# EAGLE design Pneumatic Controller Schematic (EAGLE 7.6.0)
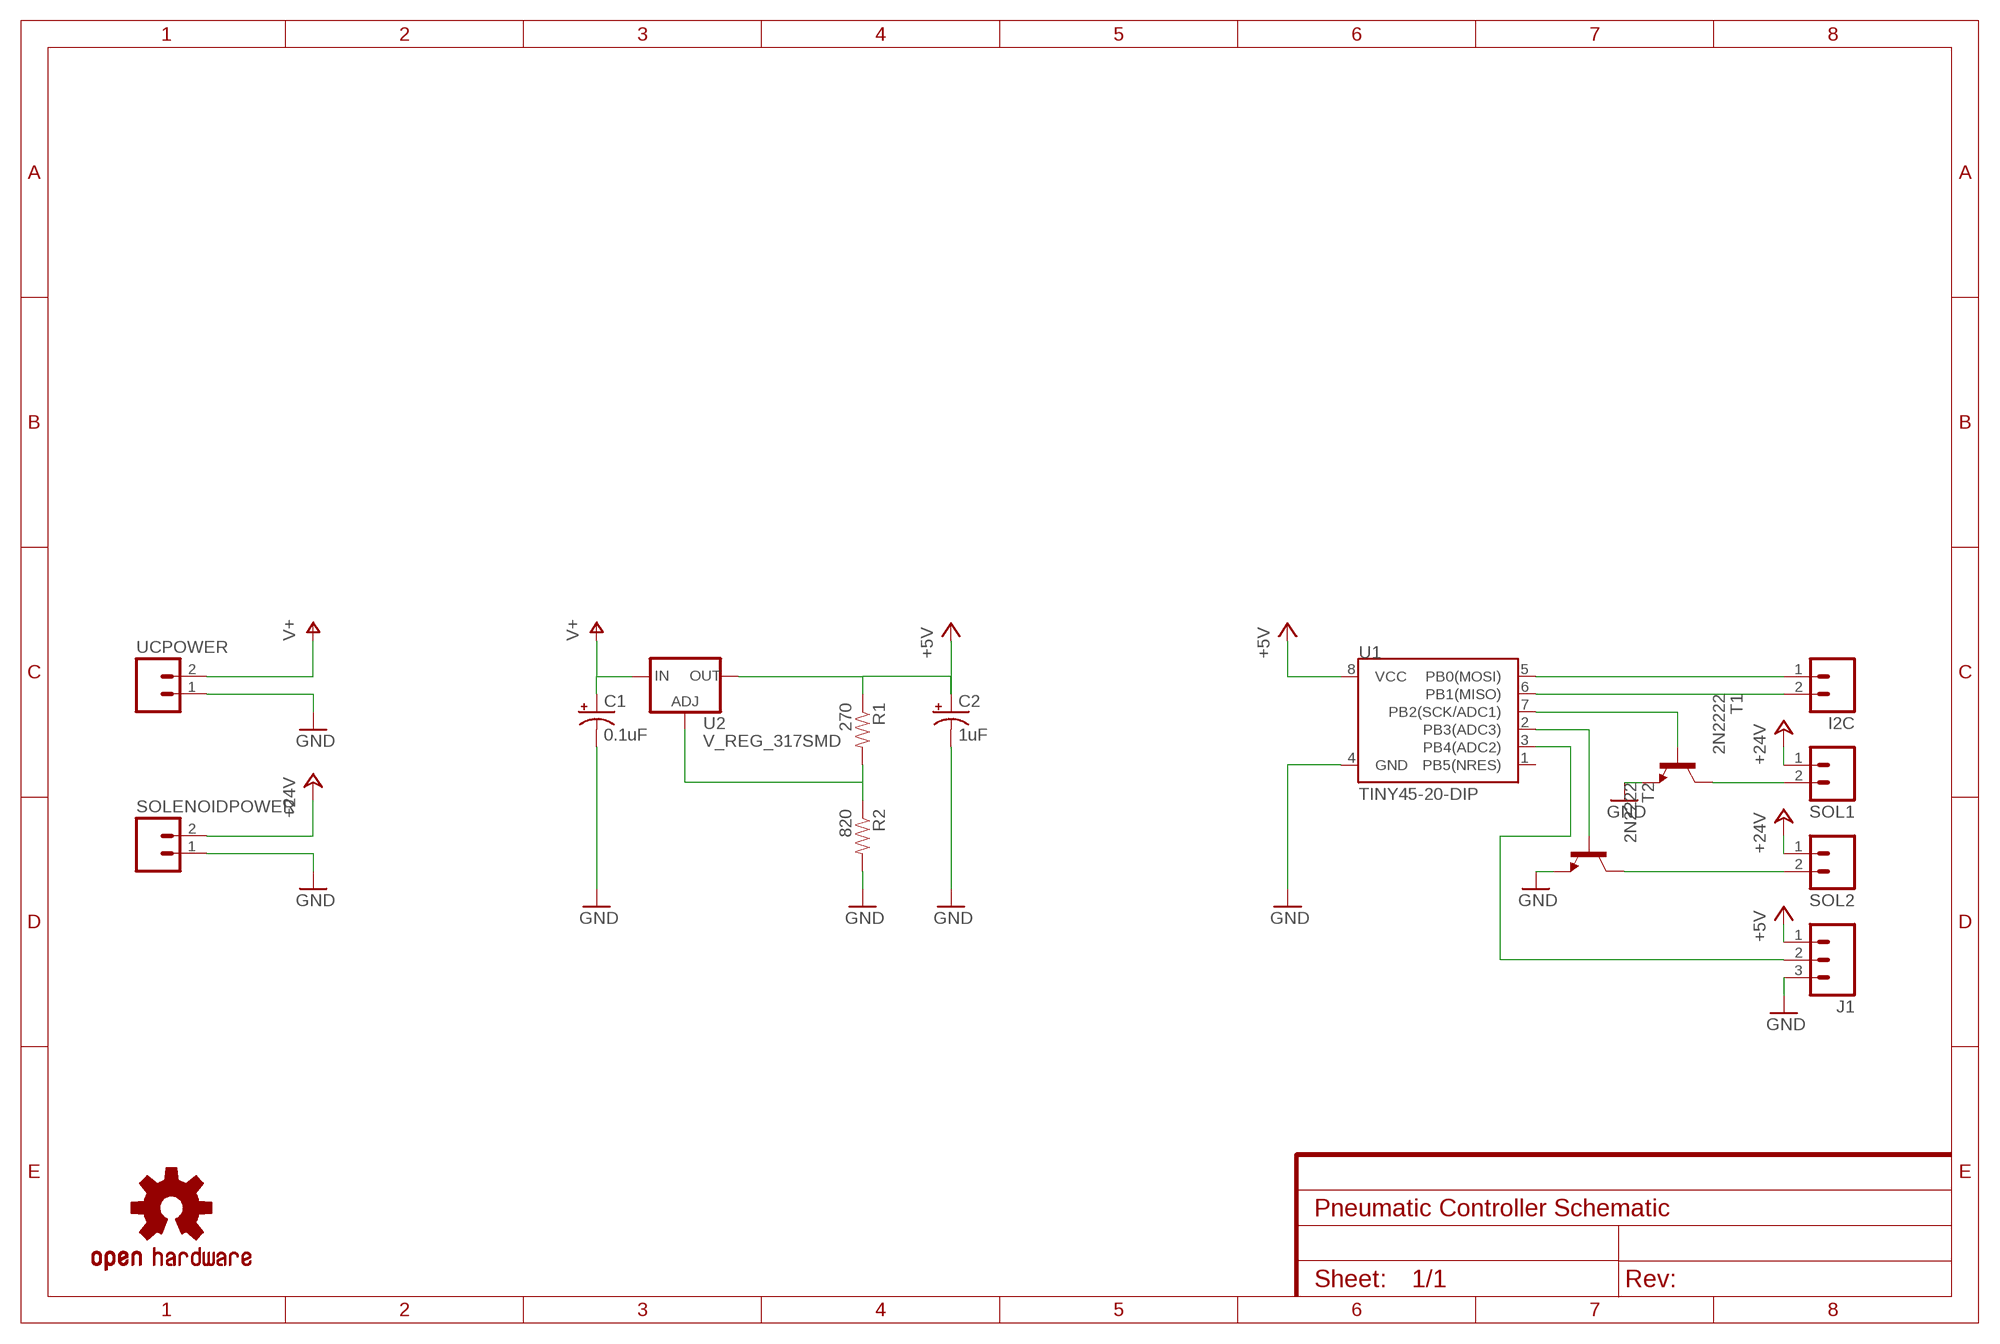
[diagram p0: schematic, sheet 1]

## Parts
C1  0.1uF  CAP_POLPTH2  [CPOL-RADIAL-10UF-25V]
C2  1uF  CAP_POLPTH2  [CPOL-RADIAL-10UF-25V]
I2C  M02PTH  [1X02]
J1  M03PTH  [1X03]
LOGO1  OSHW-LOGOS-COPPER  [OSHW-LOGO-S_COPPER]
R1  270  RESISTORPTH-1/4W  [AXIAL-0.4]
R2  820  RESISTORPTH-1/4W  [AXIAL-0.4]
SOL1  M02PTH  [1X02]
SOL2  M02PTH  [1X02]
SOLENOIDPOWER  M02PTH  [1X02]
T1  2N2222  [TO92-EBC-OVAL]
T2  2N2222  [TO92-EBC-OVAL]
U1  TINY45-20-DIP  ATTINY45TINY45-20-DIP  [DIP08]
U2  V_REG_317SMD  [SOT223]
UCPOWER  M02PTH  [1X02]

## Nets
+5V: C2.1(+) J1.1 R1.P$1 U1.8(VCC) U2.2(OUT)
+12V: UCPOWER.2 ; supply symbol labelled V+
+24V: SOL1.1 SOL2.1 SOLENOIDPOWER.2
GND: C1.2(-) C2.2(-) J1.3 R2.P$2 SOLENOIDPOWER.1 T1.E T2.E U1.4(GND) UCPOWER.1
N$1: R1.P$2 R2.P$1 U2.1(ADJ)
N$2: I2C.1 U1.5(PB0(MOSI))
N$3: I2C.2 U1.6(PB1(MISO))
N$4: T1.B U1.7(PB2(SCK/ADC1))
N$5: T2.B U1.2(PB3(ADC3))
N$6: SOL1.2 T1.C
N$7: SOL2.2 T2.C
N$8: J1.2 U1.3(PB4(ADC2))
V+: C1.1(+) U2.3(IN)
Unconnected: U1.1(PB5(NRES))

## Library data of the parts
C1 C2 = SparkFun-Capacitors:CAP_POL: Capacitor Polarized These are standard SMD and PTH capacitors. Normally 10uF, 47uF, and 100uF in electrolytic and tantalum varieties. Always verify the external diameter of the through hole cap, it varies with capacity, voltage, and manufacturer. The EIA devices should be standard.
I2C SOL1 SOL2 SOLENOIDPOWER UCPOWER = SparkFun-Connectors:M02: Standard 2-pin 0.1" header. Use with - straight break away headers ( PRT-00116) - right angle break away headers (PRT-00553) - swiss pins (PRT-00743) - machine pins (PRT-00117) - female headers (PRT-00115) Molex polarized connector foot print use with: PRT-08233 with associated crimp pins and housings. 2.54_SCREWTERM for use with PRT-10571. 3.5mm Screw Terminal footprints for PRT-08084 5mm Screw Terminal footprints for use with PRT-08432
J1 = SparkFun-Connectors:M03: Header 3 Standard 3-pin 0.1" header. Use with straight break away headers (SKU : PRT-00116), right angle break away headers (PRT-00553), swiss pins (PRT-00743), machine pins (PRT-00117), and female headers (PRT-00115). Molex polarized connector foot print use with SKU : PRT-08232 with associated crimp pins and housings.
LOGO1 = SparkFun-Aesthetics:OSHW-LOGO: Open Source Hardware Logo This logo indicates the piece of hardware it is found on incorporates a OSHW license and/or adheres to the definition of open source hardware found here: http://freedomdefined.org/OSHW
R1 R2 = SparkFun-Passives:RESISTOR: Resistor Basic schematic elements and footprints for 0603, 1206, and PTH resistors.
T1 T2 = adafruit:2N2222: NPN TRANSISTOR Big oval pads
U1 = SparkFun-DigitalIC:ATTINY45: Atmel 8-pin 2/4/8kB flash uC; PROD_ID: IC-09439
U2 = SparkFun-PowerIC:V_REG_317: Voltage Regulator Standard LM317 adjustable voltage regulator. AOI (Adjust Output Input). Google 'LM317 Calculator' for easy to use app to get the two resistor values needed. 240/720 for 5V output. 240/390 for 3.3V output. Spark Fun Electronics SKU : COM-00527

## Board
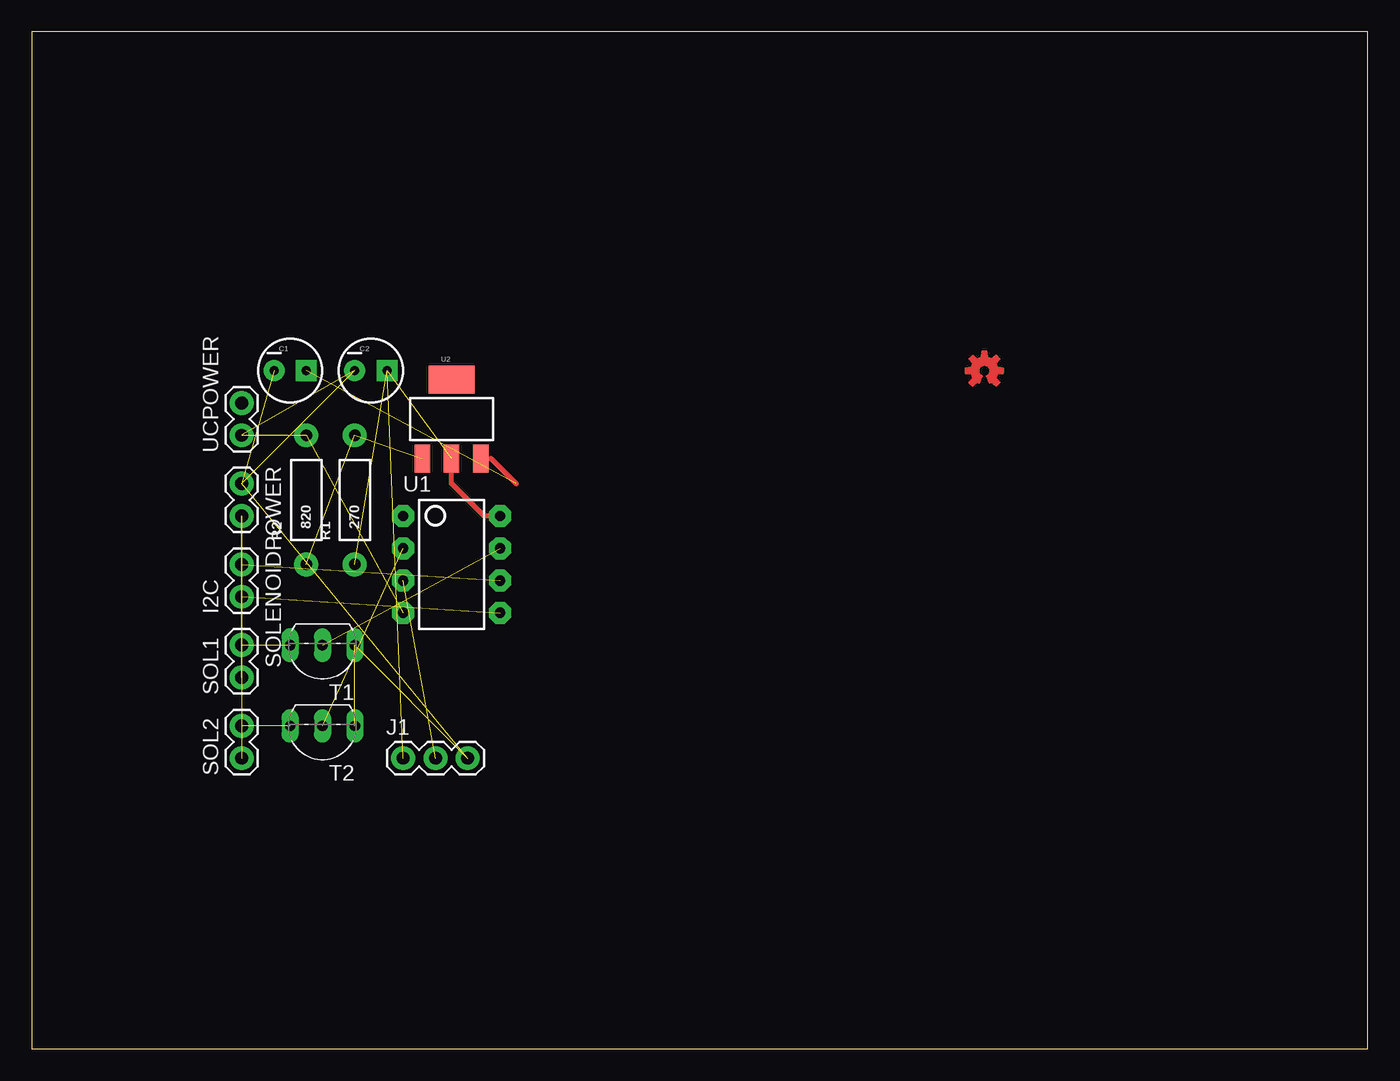
[diagram p1: board, top side]
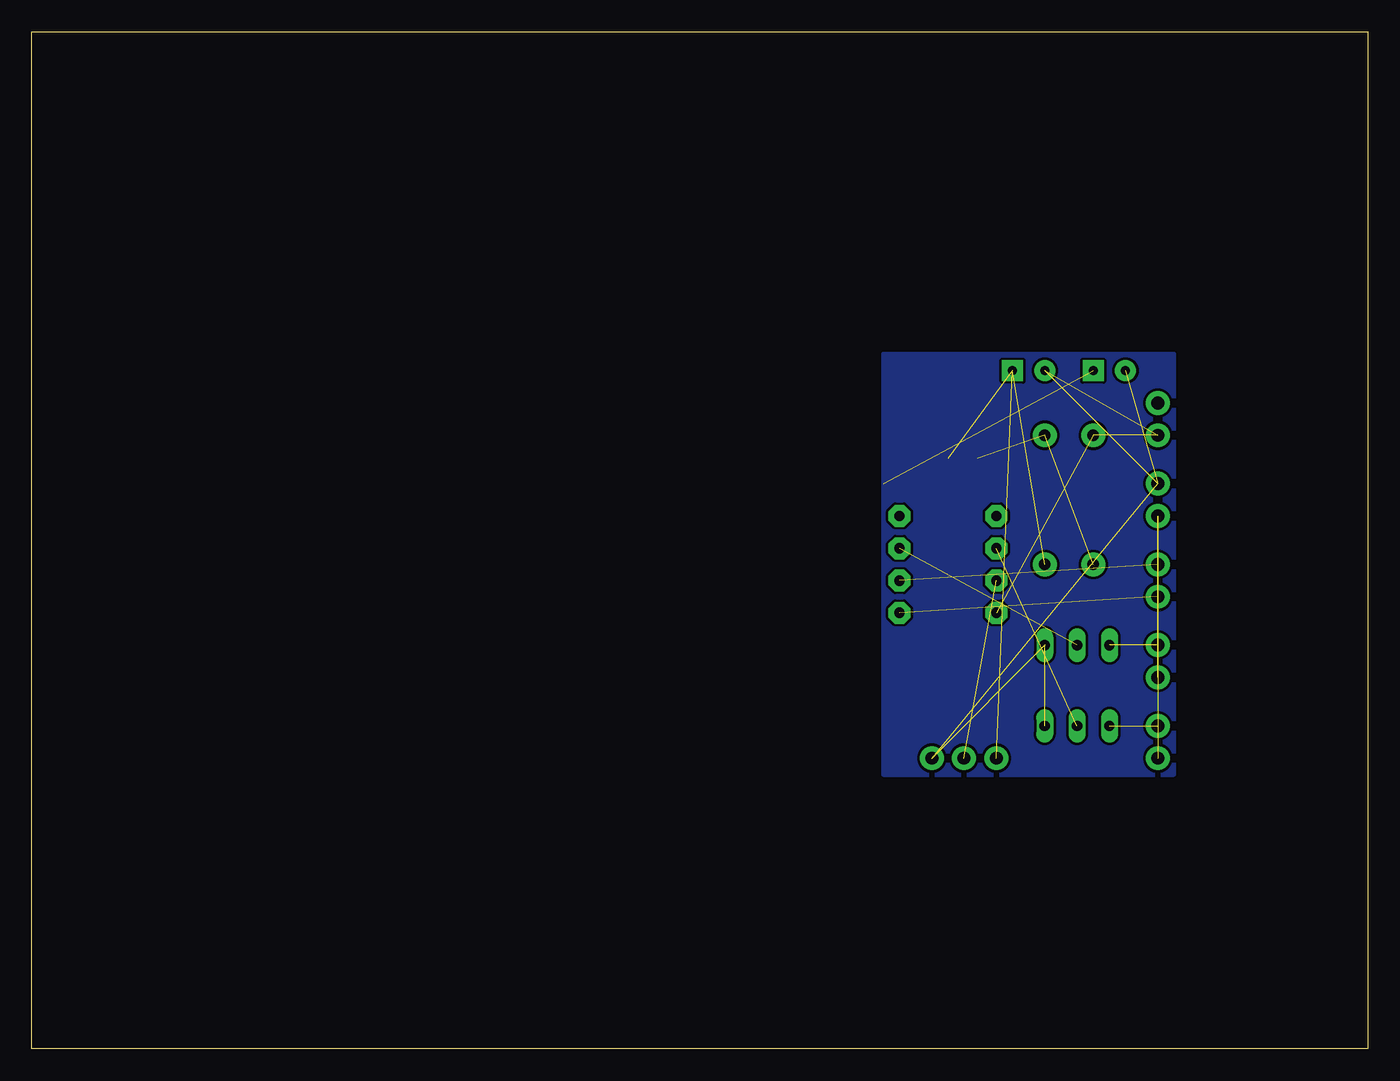
[diagram p2: board, bottom side, seen from below]

Size 105.08 x 80 mm. Coordinates in mm from the lower left corner, seen from the top.
Outline: 0,0 105.08,0 105.08,80 0,80 0,0
Copper layers (1*16): Top 0.035mm / dielectric 1.5mm / Bottom 0.035mm
Design rules "default": minimum track width 10mil, minimum drill 24mil, track to track 8mil, track to pad 8mil, pad to pad 8mil, via to via 8mil, smd to smd 8mil, copper to edge 40mil, drill to drill 8mil, minimum pad ring 10mil, minimum via ring 8mil, stop-mask expansion 4mil, vias tented up to drill 0mil, thermal gap 10mil

### Footprints (pad centres in the part's own frame; a part is rotated, then mirrored left to right if it is on the bottom)
CPOL-RADIAL-10UF-25V = drill 0.7 pad 1.651 square: 1 1.27,0 | drill 0.7 pad 1.651: 2 -1.27,0
1X02 = drill 1.016 pad 1.88: 1 0,0; 2 2.54,0
1X03 = drill 1.016 pad 1.88: 1 0,0; 2 2.54,0; 3 5.08,0
AXIAL-0.4 = drill 0.9 pad 1.88: P$1 -5.08,0; P$2 5.08,0
TO92-EBC-OVAL = drill 0.813 long: B 0,-1.27; C 2.54,-1.27; E -2.54,-1.27
DIP08 = drill 0.813 pad 1.727 octagon: 1 -3.81,-3.81; 2 -1.27,-3.81; 3 1.27,-3.81; 4 3.81,-3.81; 5 3.81,3.81; 6 1.27,3.81; 7 -1.27,3.81; 8 -3.81,3.81
SOT223 = smd 1.219 x 2.235: 1 -2.311,-3.099; 2 0,-3.099; 3 2.311,-3.099 | smd 3.6 x 2.2: 4 0,3.099

### Placement (x,y rotation side)
C1  20.32,53.34 0 top
C2  26.67,53.34 0 top
I2C  16.51,35.56 90 top
J1  29.21,22.86 0 top
LOGO1  74.93,53.34 0 top
R1  25.4,43.18 90 top
R2  21.59,43.18 90 top
SOL1  16.51,29.21 90 top
SOL2  16.51,22.86 90 top
SOLENOIDPOWER  16.51,44.45 270 top
T1  22.86,30.48 180 top
T2  22.86,24.13 180 top
U1  33.02,38.1 270 top
U2  33.02,49.53 0 top
UCPOWER  16.51,48.26 90 top

### Tracks (layer width: path | path; a pad name or v marks a point on that pad's centre or on a via)
+5V  (3 unrouted)
  Top 0.406: U1.8 35.56,41.91 33.02,44.45 U2.2
+24V  (2 unrouted)
GND  (8 unrouted)
N$1  (2 unrouted)
N$2  (1 unrouted)
N$3  (1 unrouted)
N$4  (1 unrouted)
N$5  (1 unrouted)
N$6  (1 unrouted)
N$7  (1 unrouted)
N$8  (1 unrouted)
N$9
  pour Bottom: 38.1,36.83 38.1,21.59 15.24,21.59 15.24,54.61 36.83,54.61 38.1,54.61
V+  (1 unrouted)
  Top 0.406: U2.3 36.12,46.43 38.1,44.45